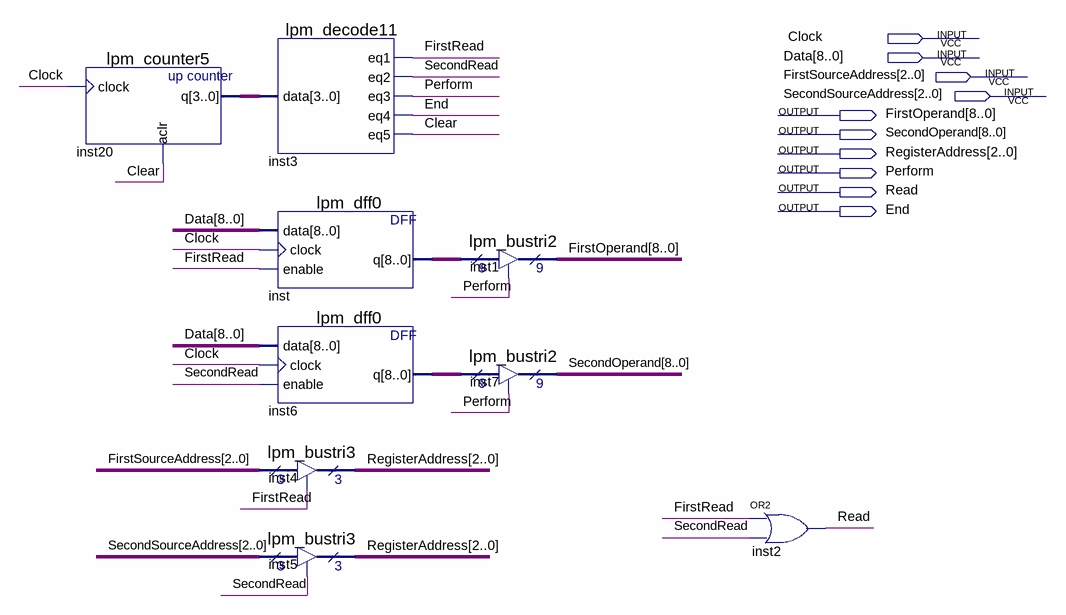
[diagram p0: schematic sheet]
// Quartus schematic NxorBlock.bdf as structural Verilog: 9 symbols, 10 pins
module NxorBlock (
  input  Clock,
  input  [8:0] Data,
  input  [2:0] FirstSourceAddress,
  input  [2:0] SecondSourceAddress,
  output [8:0] FirstOperand,
  output [8:0] SecondOperand,
  output [2:0] RegisterAddress,
  output Perform,
  output Read,
  output End
);

  wire Clear, FirstRead, SecondRead;
  wire [3:0] inst20_q;
  wire [8:0] inst6_q, inst_q;

  lpm_counter5 inst20 (.clock(Clock), .aclr(Clear), .q(inst20_q));
  lpm_decode11 inst3 (.data(inst20_q), .eq1(FirstRead), .eq2(SecondRead), .eq3(Perform), .eq4(End), .eq5(Clear));
  lpm_dff0 inst (.data(Data), .clock(Clock), .enable(FirstRead), .q(inst_q));
  lpm_dff0 inst6 (.data(Data), .clock(Clock), .enable(SecondRead), .q(inst6_q));
  lpm_bustri3 inst4 (.enabledt(FirstRead), .data(FirstSourceAddress), .tridata(RegisterAddress));
  lpm_bustri3 inst5 (.enabledt(SecondRead), .data(SecondSourceAddress), .tridata(RegisterAddress));
  lpm_bustri2 inst1 (.enabledt(Perform), .data(inst_q), .tridata(FirstOperand));
  lpm_bustri2 inst7 (.enabledt(Perform), .data(inst6_q), .tridata(SecondOperand));
  or inst2 (Read, FirstRead, SecondRead);
endmodule
